# Altium schematic sheet UD3B.SchDoc
size C; PageSetup: Record=PageOptions|CenterHorizontal=True|CenterVertical=True|PrintScale=0.54|XCorrection=1.00|YCorrection=1.00|PrintKind=0|BorderSize=5000000|LeftOffset=0|BottomOffset=0|Orientation=2|PaperLength=1000|PaperWidth=1000|Scale=100|PaperSource=7|PrintQuality=-4|MediaType=1|DitherType=10|PaperKind=Letter|PrintScaleMode=1
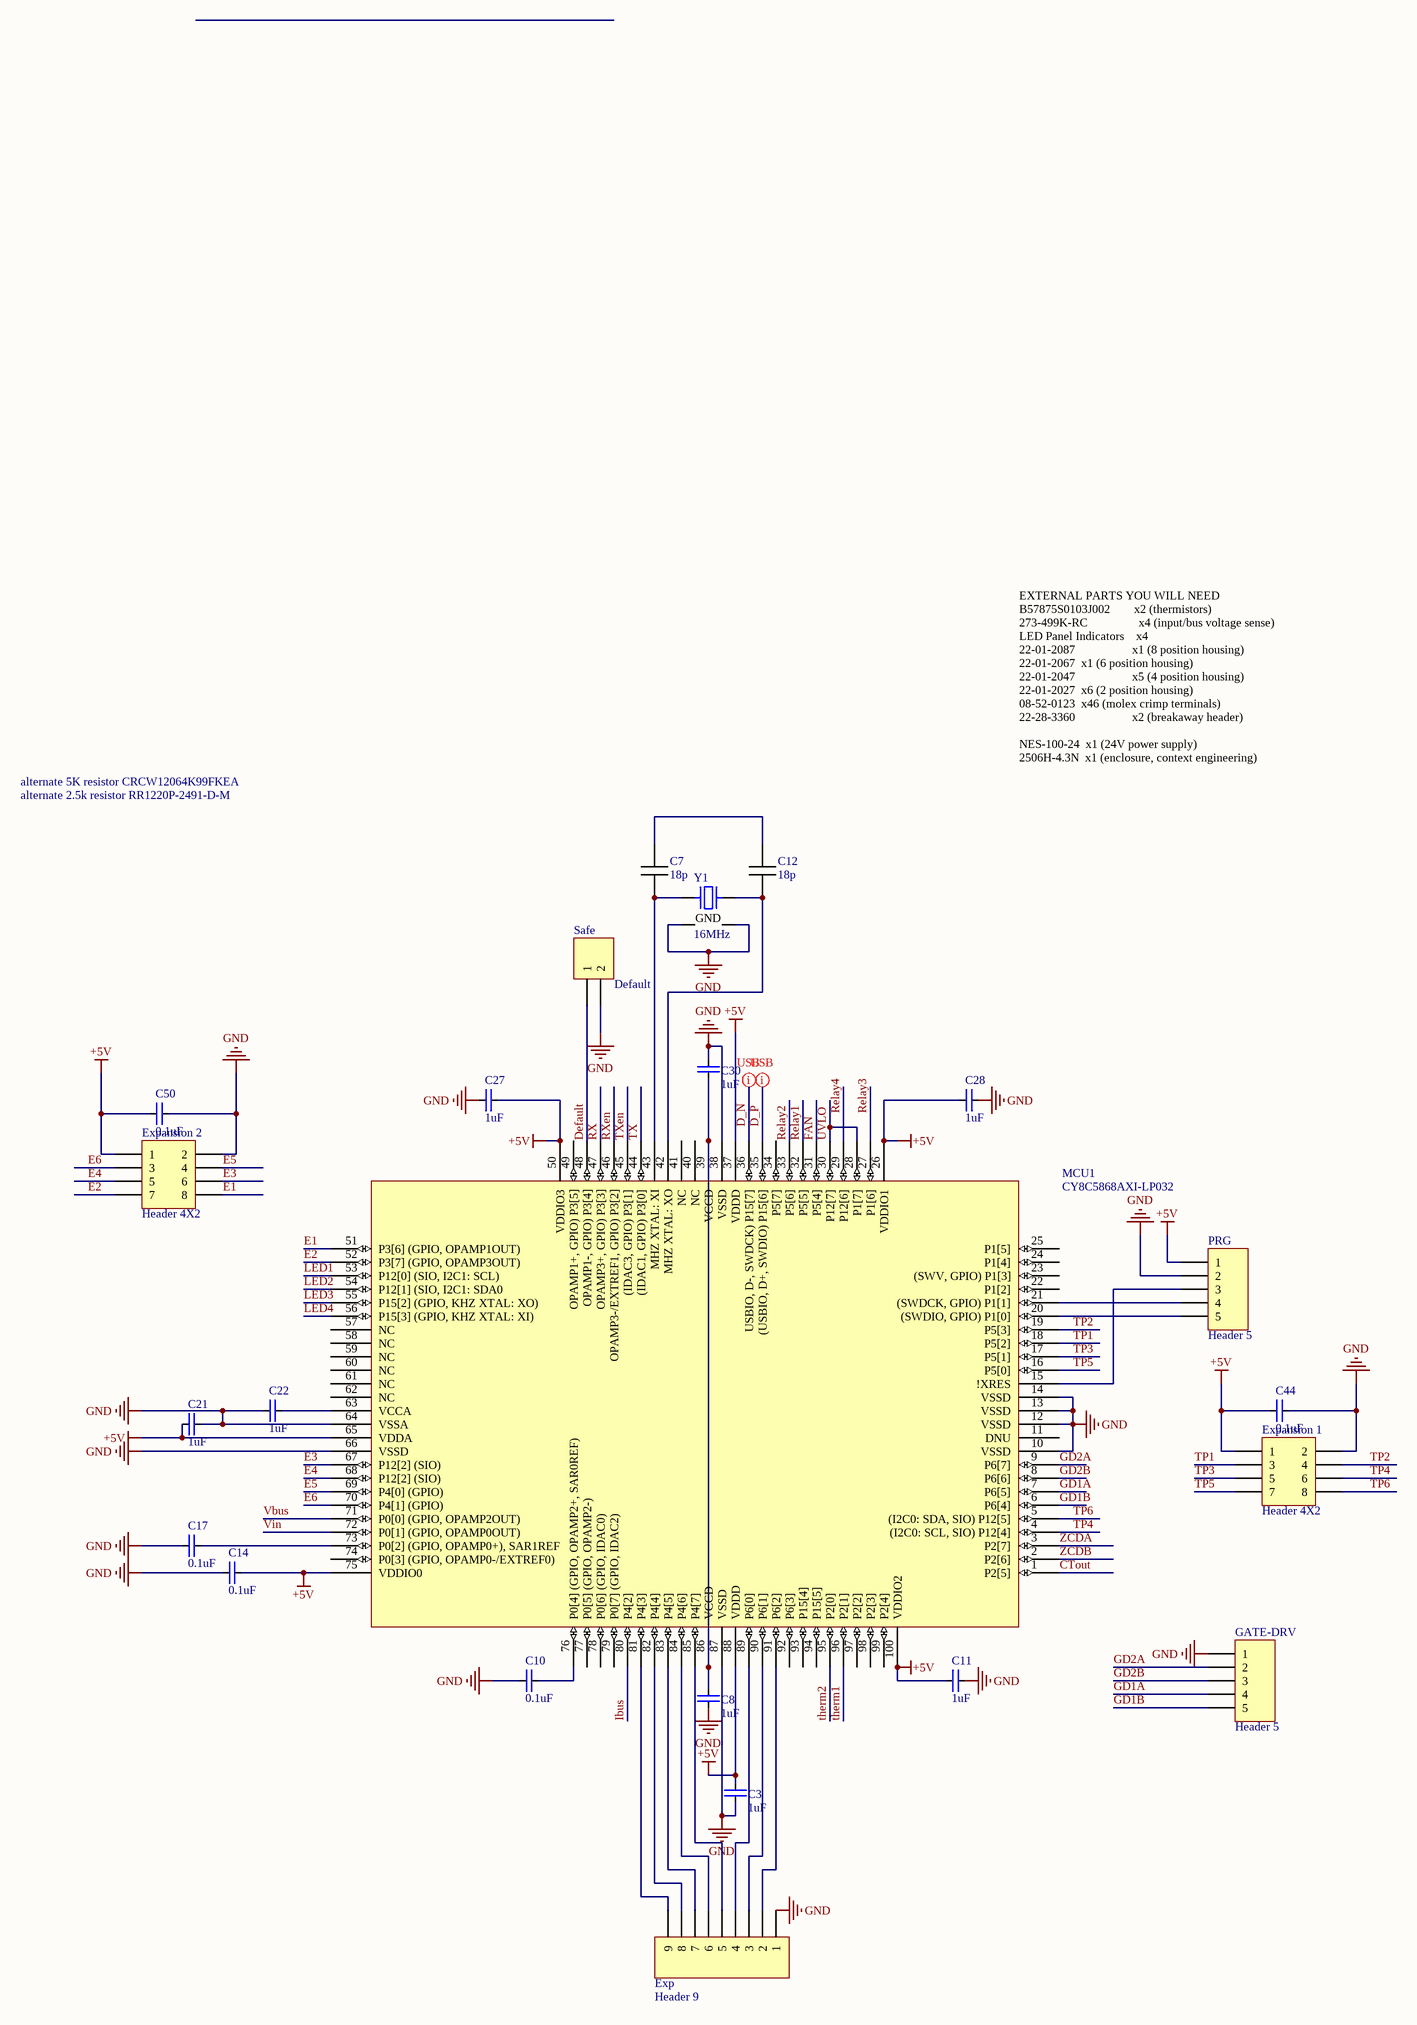
[diagram p0: UD3B.SchDoc]

## Parts
C3  value 1uF  [0805C]  (hidden comment: C0805C105K4RACTU)
C7  Capacitance: 18p  [0805C]  (hidden comment: VJ0805A180GXACW1BC)
C8  value 1uF  [0805C]  (hidden comment: C0805C105K4RACTU)
C10  value 0.1uF  [0805C]  (hidden comment: C0805C104K5RACTU)
C11  value 1uF  [0805C]  (hidden comment: C0805C105K4RACTU)
C12  Capacitance: 18p  [0805C]  (hidden comment: VJ0805A180GXACW1BC)
C14  value 0.1uF  [0805C]  (hidden comment: C0805C104K5RACTU)
C17  value 0.1uF  [0805C]  (hidden comment: C0805C104K5RACTU)
C21  value 1uF  [0805C]  (hidden comment: C0805C105K4RACTU)
C22  value 1uF  [0805C]  (hidden comment: C0805C105K4RACTU)
C27  value 1uF  [0805C]  (hidden comment: C0805C105K4RACTU)
C28  value 1uF  [0805C]  (hidden comment: C0805C105K4RACTU)
C30  value 1uF  [0805C]  (hidden comment: C0805C105K4RACTU)
C44  value 0.1uF  [0805C]  (hidden comment: C0805C104K5RACTU)
C50  value 0.1uF  [0805C]  (hidden comment: C0805C104K5RACTU)
Exp  Header 9  [HDR1X9]
Expansion_1  Header 4X2  [HDR2X4]
Expansion_2  Header 4X2  [HDR2X4]
GATE-DRV  Header 5  [HDR1X5]
MCU1  CY8C5868AXI-LP032  [TQFP100]
PRG  Header 5  [HDR1X5]
Safe  Default  [HDR1X2]
Y1  16MHz  [ABRACON ABM8G]

## Nets
+5V: C3.1 C11.1 C14.2 C21.2 C27.1 C28.2 C44.2 C50.2 Expansion_1.1 Expansion_2.1 MCU1.26(VDDIO1) MCU1.37(VDDD) MCU1.50(VDDIO3) MCU1.65(VDDA) MCU1.75(VDDIO0) MCU1.88(VDDD) MCU1.100(VDDIO2) PRG.1
GND: C3.2 C8.2 C10.1 C11.2 C14.1 C17.1 C21.1 C22.2 C27.2 C28.1 C30.2 C44.1 C50.1 Exp.1 Expansion_1.2 Expansion_2.2 GATE-DRV.1 MCU1.10(VSSD) MCU1.12(VSSD) MCU1.13(VSSD) MCU1.14(VSSD) MCU1.38(VSSD) MCU1.64(VSSA) MCU1.66(VSSD) MCU1.87(VSSD) PRG.2 Safe.2 Y1.2(GND) Y1.4(GND)
CTout: MCU1.1(P2[5])
D_N: MCU1.36(USBIO,_D-,_SWDCK)_P15[7])
D_P: MCU1.35((USBIO,_D+,_SWDIO)_P15[6])
Default: MCU1.48(OPAMP1-,_GPIO)_P3[4]) Safe.1
E1: Expansion_2.8 MCU1.51(P3[6]_(GPIO,_OPAMP1OUT))
E2: Expansion_2.7 MCU1.52(P3[7]_(GPIO,_OPAMP3OUT))
E3: Expansion_2.6 MCU1.67(P12[2]_(SIO))
E4: Expansion_2.5 MCU1.68(P12[2]_(SIO))
E5: Expansion_2.4 MCU1.69(P4[0]_(GPIO))
E6: Expansion_2.3 MCU1.70(P4[1]_(GPIO))
FAN: MCU1.31(P5[4])
GD1A: GATE-DRV.4 MCU1.7(P6[5])
GD1B: GATE-DRV.5 MCU1.6(P6[4])
GD2A: GATE-DRV.2 MCU1.9(P6[7])
GD2B: GATE-DRV.3 MCU1.8(P6[6])
Ibus: MCU1.80(P4[2])
LED1: MCU1.53(P12[0]_(SIO,_I2C1:_SCL))
LED2: MCU1.54(P12[1]_(SIO,_I2C1:_SDA0)
LED3: MCU1.55(P15[2]_(GPIO,_KHZ_XTAL:_XO))
LED4: MCU1.56(P15[3]_(GPIO,_KHZ_XTAL:_XI))
Relay1: MCU1.32(P5[5])
Relay2: MCU1.33(P5[6])
Relay3: MCU1.27(P1[6])
Relay4: MCU1.29(P12[6])
RX: MCU1.47(OPAMP3+,_GPIO)_P3[3])
RXen: MCU1.46(OPAMP3-/EXTREF1,_GPIO)_P3[2])
therm1: MCU1.96(P2[1])
therm2: MCU1.95(P2[0])
TP1: Expansion_1.3 MCU1.18(P5[2])
TP2: Expansion_1.4 MCU1.19(P5[3])
TP3: Expansion_1.5 MCU1.17(P5[1])
TP4: Expansion_1.6 MCU1.4((I2C0:_SCL,_SIO)_P12[4])
TP5: Expansion_1.7 MCU1.16(P5[0])
TP6: Expansion_1.8 MCU1.5((I2C0:_SDA,_SIO)_P12[5])
TX: MCU1.44((IDAC1,_GPIO)_P3[0])
TXen: MCU1.45((IDAC3,_GPIO)_P3[1])
UVLO: MCU1.28(P1[7]) MCU1.30(P12[7])
Vbus: MCU1.71(P0[0]_(GPIO,_OPAMP2OUT))
Vin: MCU1.72(P0[1]_(GPIO,_OPAMP0OUT))
ZCDA: MCU1.3(P2[7])
ZCDB: MCU1.2(P2[6])
NetC7_1: C7.1 C12.1
NetC7_2: C7.2 MCU1.43(MHZ_XTAL:_XI) Y1.1
NetC8_1: C8.1 C30.1 MCU1.39(VCCD) MCU1.86(VCCD)
NetC10_2: C10.2 MCU1.76(P0[4]_(GPIO,_OPAMP2+,_SAR0REF))
NetC12_2: C12.2 MCU1.42(MHZ_XTAL:_XO) Y1.3
NetC17_2: C17.2 MCU1.73(P0[2]_(GPIO,_OPAMP0+),_SAR1REF)
NetC22_1: C22.1 MCU1.63(VCCA)
NetExp_2: Exp.2 MCU1.91(P6[2])
NetExp_3: Exp.3 MCU1.90(P6[1])
NetExp_4: Exp.4 MCU1.89(P6[0])
NetExp_5: Exp.5 MCU1.85(P4[7])
NetExp_6: Exp.6 MCU1.84(P4[6])
NetExp_7: Exp.7 MCU1.83(P4[5])
NetExp_8: Exp.8 MCU1.82(P4[4])
NetExp_9: Exp.9 MCU1.81(P4[3])
NetMCU1_15: MCU1.15(!XRES) PRG.3
NetMCU1_20: MCU1.20((SWDIO,_GPIO)_P1[0]) PRG.5
NetMCU1_21: MCU1.21((SWDCK,_GPIO)_P1[1]) PRG.4

Not connected (* = marked no-connect by the designer): MCU1 11(DNU) 22(P1[2]) 23((SWV,_GPIO)_P1[3]) 24(P1[4]) 25(P1[5]) 34(P5[7]) 40(NC) 41(NC) 49(OPAMP1+,_GPIO)_P3[5]) 57(NC) 58(NC) 59(NC) 60(NC) 61(NC) 62(NC) 74(P0[3]_(GPIO,_OPAMP0-/EXTREF0)) 77(P0[5]_(GPIO,_OPAMP2-)) 78(P0[6]_(GPIO,_IDAC0)) 79(P0[7]_(GPIO,_IDAC2)) 92(P6[3]) 93(P15[4]) 94(P15[5]) 97(P2[2]) 98(P2[3]) 99(P2[4])

## Layout directives
differential pair: D_N, D_P

## Notes on the sheet
- alternate 5K resistor CRCW12064K99FKEA
- alternate 2.5k resistor RR1220P-2491-D-M
- EXTERNAL PARTS YOU WILL NEED
  B57875S0103J002       	x2 (thermistors)
  273-499K-RC                	x4 (input/bus voltage sense)
  LED Panel Indicators   	x4
  22-01-2087                  	x1 (8 position housing)
  22-01-2067		x1 (6 position housing)
  22-01-2047                  	x5 (4 position housing)
  22-01-2027		x6 (2 position housing)
  08-52-0123		x46 (molex crimp terminals)
  22-28-3360                  	x2 (breakaway header)
  NES-100-24		x1 (24V power supply)
  2506H-4.3N		x1 (enclosure, context engineering)

## Library data of the parts
C3 C8 C11 C21 C22 C27 C28 C30 = C0805C105K4RACTU: Capacitor, 1uF, MLCC, 16V, X7R, 10%, SMD
C7 C12 = Capacitor: tolerance: *; type: *; material: *
C10 C14 C17 C44 C50 = C0805C104K5RACTU: Capacitor, 0.1uF, MLCC, 50V, X7R, 10%, SMD
Exp = Header 9: Header, 9-Pin; LatestRevisionDate: 17-Jul-2002; LatestRevisionNote: Re-released for DXP Platform.; Publisher: Altium Limited
Expansion_1 Expansion_2 = Header 4X2: Header, 4-Pin, Dual row; LatestRevisionDate: 17-Jul-2002; LatestRevisionNote: Re-released for DXP Platform.; Publisher: Altium Limited
GATE-DRV PRG = Header 5: Header, 5-Pin; LatestRevisionDate: 17-Jul-2002; LatestRevisionNote: Re-released for DXP Platform.; Publisher: Altium Limited
MCU1 = CY8C5466AXI-064
Safe = Header 2: Header, 2-Pin; LatestRevisionDate: 17-Jul-2002; LatestRevisionNote: Re-released for DXP Platform.; Publisher: Altium Limited
Y1 = ABM8G-16.000MHZ-18-D2Y-T3: CRYSTAL 16.0000MHZ 18PF SMD; Manufacturer: Abracon LLC; ESR (Equivalent Series Resistance): 80 Ohms; Frequency Stability: ±30ppm; Frequency Tolerance: ±20ppm; Operating Mode: Fundamental; Part Number: ABM8G-16.000MHZ-18-D2Y-T3; ComponentLink1Description: Datasheet; ComponentLink1URL: https://abracon.com/Resonators/ABM8G.pdf; ComponentLink2Description: DigiKey Link; ComponentLink2URL: http://digikey.com/product-detail/en/abracon-llc/ABM8G-16.000MHZ-18-D2Y-T3/535-14314-1-ND/8538154; Device Package: 4-SMD, No Lead; Frequency: 16MHz; Height - Seated (Max): 0.039" (1.00mm); LastUpdated: 15.01.2020 00:15:56; Lifecycle Status: Active; Load Capacitance: 18pF; Minimum Order: 1; Mounting Type: Surface Mount; Operating Temperature: -40°C ~ 85°C; Package / Case: 4-SMD, No Lead; Packaging: TapeAndReel; PartId: 348; Part Status: Active; Price: 0.51; Series: ABM8G; Size / Dimension: 0.126" L x 0.098" W (3.20mm x 2.50mm); Supplier 1: DigiKey; Supplier Part Number 1: 535-14314-1-ND; Type: MHz Crystal; Value: 16MHz